# EAGLE design Ayrduino_v6_mint (EAGLE 6.4)
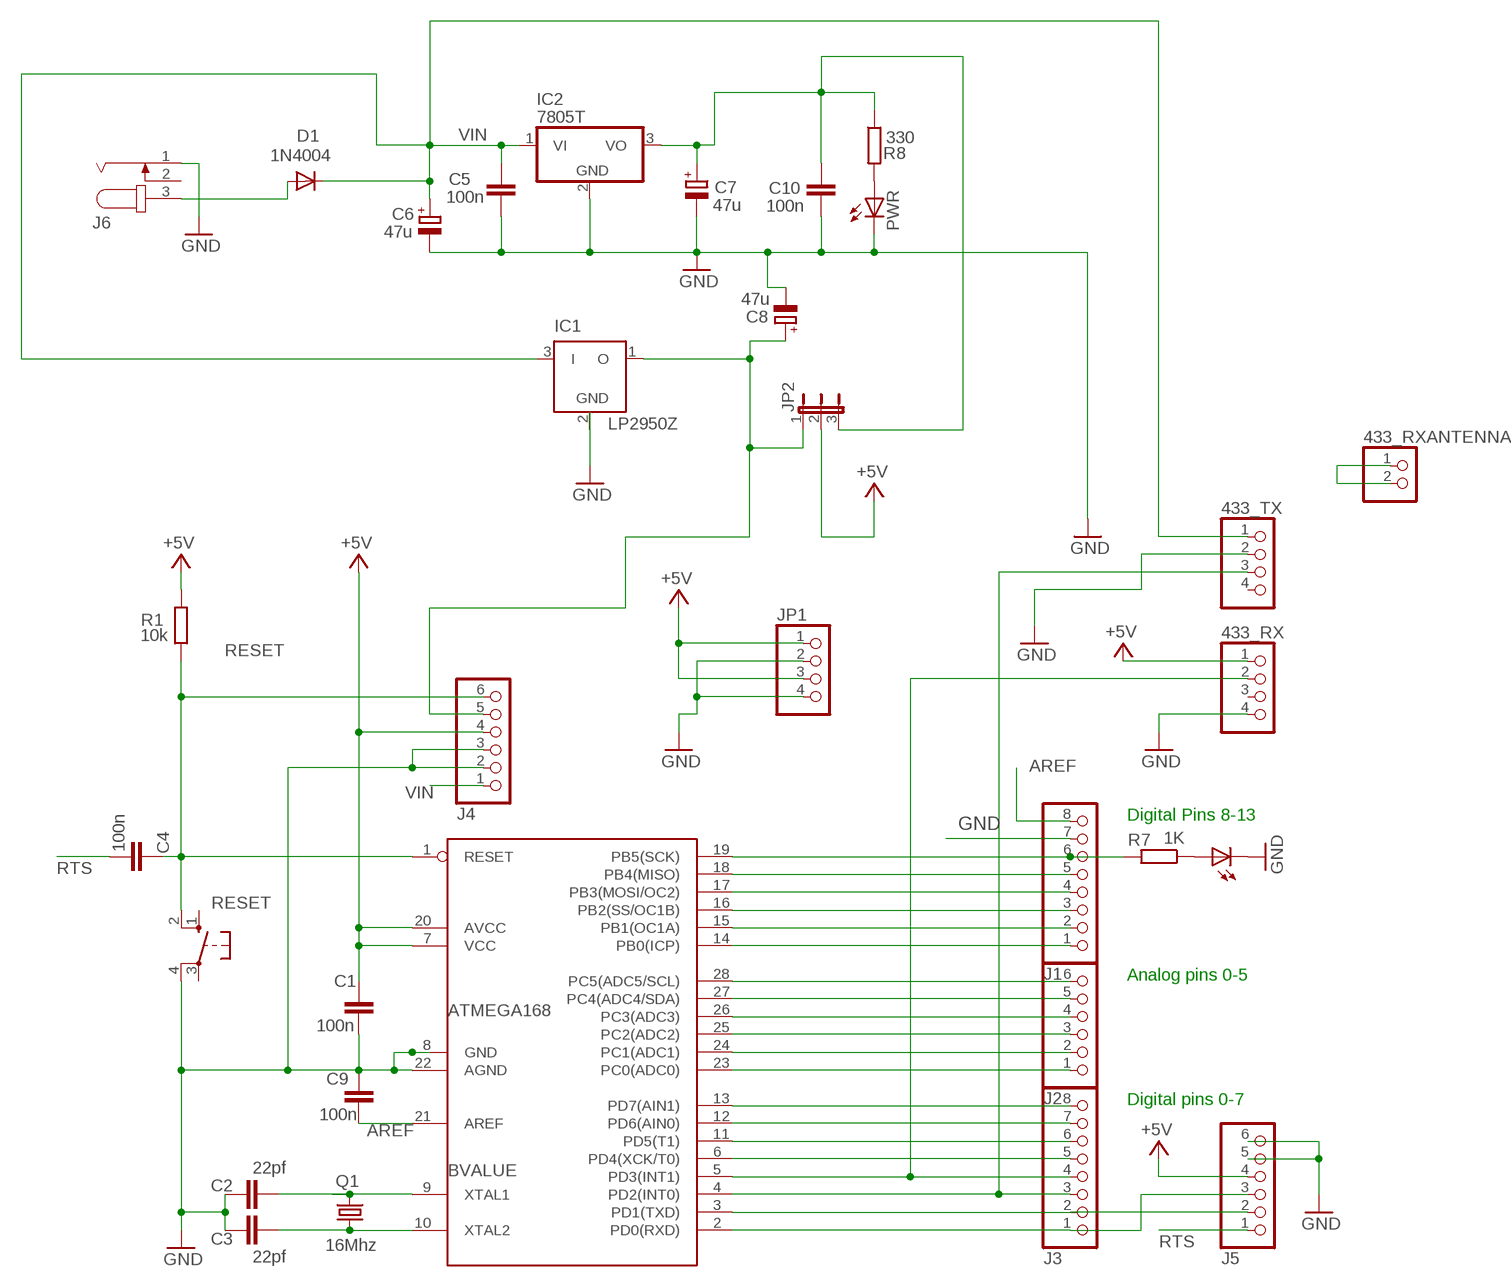
[diagram p0: schematic, sheet 1]

## Parts
433_RX  PINHD-1X4  [1X04]
433_RXANTENNA  PINHD-1X2  [1X02]
433_TX  PINHD-1X4  [1X04]
BVALUE  ATMEGA168  MEGA8-P  [DIL28-3]
C1  100n  C-EU050-024X044  [C050-024X044]
C2  22pf  C-EU025-024X044  [C025-024X044]
C3  22pf  C-EU025-024X044  [C025-024X044]
C4  100n  C-EU050-024X044  [C050-024X044]
C5  100n  C-EU050-024X044  [C050-024X044]
C6  47u  CPOL-EUE3.5-8  [E3,5-8]
C7  47u  CPOL-EUE3.5-8  [E3,5-8]
C8  47u  CPOL-EUE3.5-8  [E3,5-8]
C9  100n  C-EU050-024X044  [C050-024X044]
C10  100n  C-EU050-024X044  [C050-024X044]
D1  1N4004  DIODEPTH  [DIODE-0.4]
IC1  LP2950Z  [TO92]
IC2  7805T  [TO220H]
J1  PINHD-1X8  [1X08]
J2  PINHD-1X6  [1X06]
J3  PINHD-1X8  [1X08]
J4  PINHD-1X6  [1X06]
J5  PINHD-1X6  [1X06]
J6  JACK-PLUG0  [SPC4077]
JP1  PINHD-1X4  [1X04]
JP2  JP2E  [JP2]
P13  LED3MM  [LED3MM]
PWR  LED3MM  [LED3MM]
Q1  16Mhz  CRYSTALHC49U-V  [HC49U-V]
R1  10k  R-EU_0204/7  [0204/7]
R7  1K  R-EU_0204/7  [0204/7]
R8  330  R-EU_0204/7  [0204/7]
RESET  10-XX  [B3F-10XX]

## Nets
+5V [power]: 433_RX.1 BVALUE.7(VCC) BVALUE.20(AVCC) C1.1 J4.4 J5.4 JP1.1 JP1.3 JP2.2 R1.2
AREF: BVALUE.21(AREF) C9.1 J1.8
GND [power]: 433_RX.4 433_TX.2 BVALUE.8(GND) BVALUE.22(AGND) C1.2 C2.1 C3.1 C5.1 C6.- C7.- C8.- C9.2 C10.1 IC2.2(GND) J1.7 J4.2 J4.3 J5.5 J5.6 J6.1 JP1.2 JP1.4 P13.K(C) PWR.K(C) RESET.4(P1)
N$1: BVALUE.2(PD0(RXD)) J3.1 J5.3
N$2: BVALUE.15(PB1(OC1A)) J1.2
N$3: PWR.A R8.2
N$5: D1.A J6.3
N$6: BVALUE.9(XTAL1) C2.2 Q1.2
N$9: C8.+ IC1.1(O) J4.5 JP2.1
N$10: 433_TX.3 BVALUE.4(PD2(INT0)) J3.3
N$11: 433_RX.2 BVALUE.5(PD3(INT1)) J3.4
N$12: BVALUE.6(PD4(XCK/T0)) J3.5
N$13: BVALUE.11(PD5(T1)) J3.6
N$14: BVALUE.12(PD6(AIN0)) J3.7
N$15: BVALUE.13(PD7(AIN1)) J3.8
N$16: BVALUE.23(PC0(ADC0)) J2.1
N$17: BVALUE.24(PC1(ADC1)) J2.2
N$18: BVALUE.25(PC2(ADC2)) J2.3
N$19: BVALUE.26(PC3(ADC3)) J2.4
N$20: BVALUE.27(PC4(ADC4/SDA)) J2.5
N$21: BVALUE.28(PC5(ADC5/SCL)) J2.6
N$22: BVALUE.3(PD1(TXD)) J3.2 J5.2
N$23: BVALUE.16(PB2(SS/OC1B)) J1.3
N$24: 433_RXANTENNA.1 433_RXANTENNA.2
N$25 [power]: C7.+ C10.2 IC2.3(VO) JP2.3 R8.1
N$26: BVALUE.18(PB4(MISO)) J1.5
N$28: BVALUE.14(PB0(ICP)) J1.1
N$31: BVALUE.10(XTAL2) C3.2 Q1.1
N$32: P13.A R7.1
N$43: BVALUE.17(PB3(MOSI/OC2)) J1.4
RESET: BVALUE.1(RESET) C4.1 J4.6 R1.1 RESET.2(S1)
RTS: C4.2 J5.1
SCK: BVALUE.19(PB5(SCK)) J1.6 R7.2
VIN [power]: 433_TX.1 C5.2 C6.+ D1.C IC1.3(I) IC2.1(VI) J4.1
Unconnected: 433_RX.3 433_TX.4 J6.2 RESET.1(S) RESET.3(P)

## Notes on the sheet
- Digital Pins 8-13
- Analog pins 0-5
- Digital pins 0-7

## Power pins joined to a net without a drawn wire
GND: IC1.2(GND)

## Library data of the parts
433_RX 433_TX JP1 = pinhead:PINHD-1X4: PIN HEADER
433_RXANTENNA = pinhead:PINHD-1X2: PIN HEADER
BVALUE = my-library:MEGA8-P: MICROCONTROLLER 8 Kbytes FLASH 1 kbytes SRAM 512 bytes EEPROM USART 4-channel 10 bit ADC 2-channel 8 bit ADC Source: avr.lbr
C1-C5 C9 C10 = rcl:C-EU: CAPACITOR, European symbol
C6-C8 = rcl:CPOL-EU: POLARIZED CAPACITOR, European symbol
D1 = SparkFunEagle-6-6-07:DIODE: Diode These are standard reverse protection diodes and small signal diodes. SMA package can handle up to about 1A. SOD-323 can handle about 200mA. What the SOD-323 package when ordering, there are some mfgs out there that are 5-pin packages.
IC1 = linear:LP2950: 100 mA, Low Power Low Dropout Voltage Regulator Source: http://www.onsemi.com/pub/Collateral/LP2950-D.PDF
IC2 = linear:78*: Positive VOLTAGE REGULATOR Source: http://cache.national.com/ds/LM/LM78L05.pdf http://www.fairchildsemi.com/ds/LM/LM7805.pdf
J1 J3 = pinhead:PINHD-1X8: PIN HEADER
J2 J4 J5 = pinhead:PINHD-1X6: PIN HEADER
J6 = con-jack:JACK-PLUG: DC POWER JACK Power Jack, DC, Right Angle, Through Hole, Rated 5A at 16VDC, PC Terminals Distributor: Farnell (www.Farnell.de) Drawing: 84N1161.pdf / 84N1162.pdf Manufacturer: SPC Technology (www.spctechnology.com) Type: SPC4077 / SPC 4078; OC_FARNELL: unknown; OC_NEWARK: unknown
JP2 = jumper:JP2E: JUMPER
P13 PWR = led:LED: LED OSRAM: - CHIPLED LG R971, LG N971, LY N971, LG Q971, LY Q971, LO R971, LY R971 LH N974, LH R974 LS Q976, LO Q976, LY Q976 LO Q996 - Hyper CHIPLED LW Q18S LB Q993, LB Q99A, LB R99A - SideLED LS A670, LO A670, LY A670, LG A670, LP A670 LB A673, LV A673, LT A673, LW A673 LH A674 LY A675 LS A676, LA A676, LO A676, LY A676, LW A676 LS A679, LY A679, LG A679 - Hyper Micro SIDELED® LS Y876, LA Y876, LO Y876, LY Y876 LT Y87S - SmartLED LW L88C, LW L88S LB L89C, LB L89S, LG L890 LS L89K, LO L89K, LY L89K LS L896, LA L896, LO L896, LY L896 - TOPLED LS T670, LO T670, LY T670, LG T670, LP T670 LSG T670, LSP T670, LSY T670, LOP T670, LYG T670 LG T671, LOG T671, LSG T671 LB T673, LV T673, LT T673, LW T673 LH T674 LS T676, LA T676, LO T676, LY T676, LB T676, LH T676, LSB T676, LW T676 LB T67C, LV T67C, LT T67C, LS T67K, LO T67K, LY T67K, LW E67C LS E67B, LA E67B, LO E67B, LY E67B, LB E67C, LV E67C, LT E67C LW T67C LS T679, LY T679, LG T679 LS T770, LO T770, LY T770, LG T770, LP T770 LB T773, LV T773, LT T773, LW T773 LH T774 LS E675, LA E675, LY E675, LS T675 LS T776, LA T776, LO T776, LY T776, LB T776 LHGB T686 LT T68C, LB T68C - Hyper Mini TOPLED® LB M676 - Mini TOPLED Santana® LG M470 LS M47K, LO M47K, LY M47K Source: http://www.osram.convergy.de/
Q1 = crystal:CRYSTAL: CRYSTAL
R1 R7 R8 = rcl:R-EU_: RESISTOR, European symbol
RESET = switch-omron:10-XX: OMRON SWITCH

## Net classes
0 default: width 0.203 mm, clearance 0.203 mm
1 power: width 0.6 mm, clearance 0.305 mm
2 finepitch: width 0.203 mm, clearance 0.203 mm

## Board
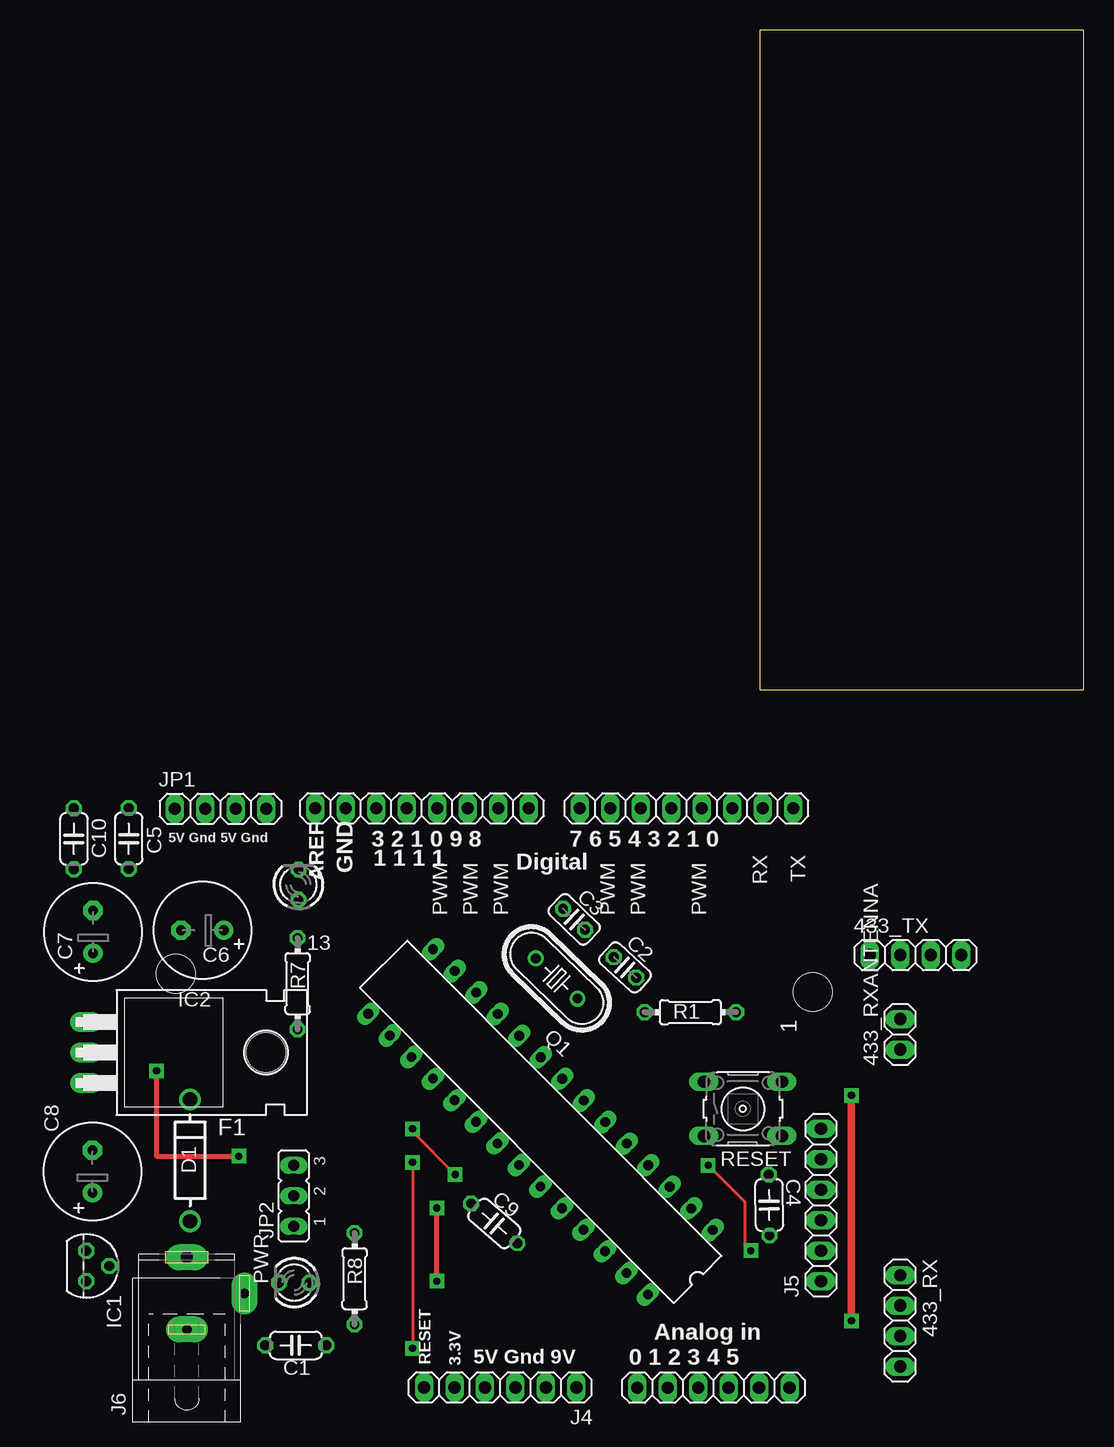
[diagram p1: board, top side]
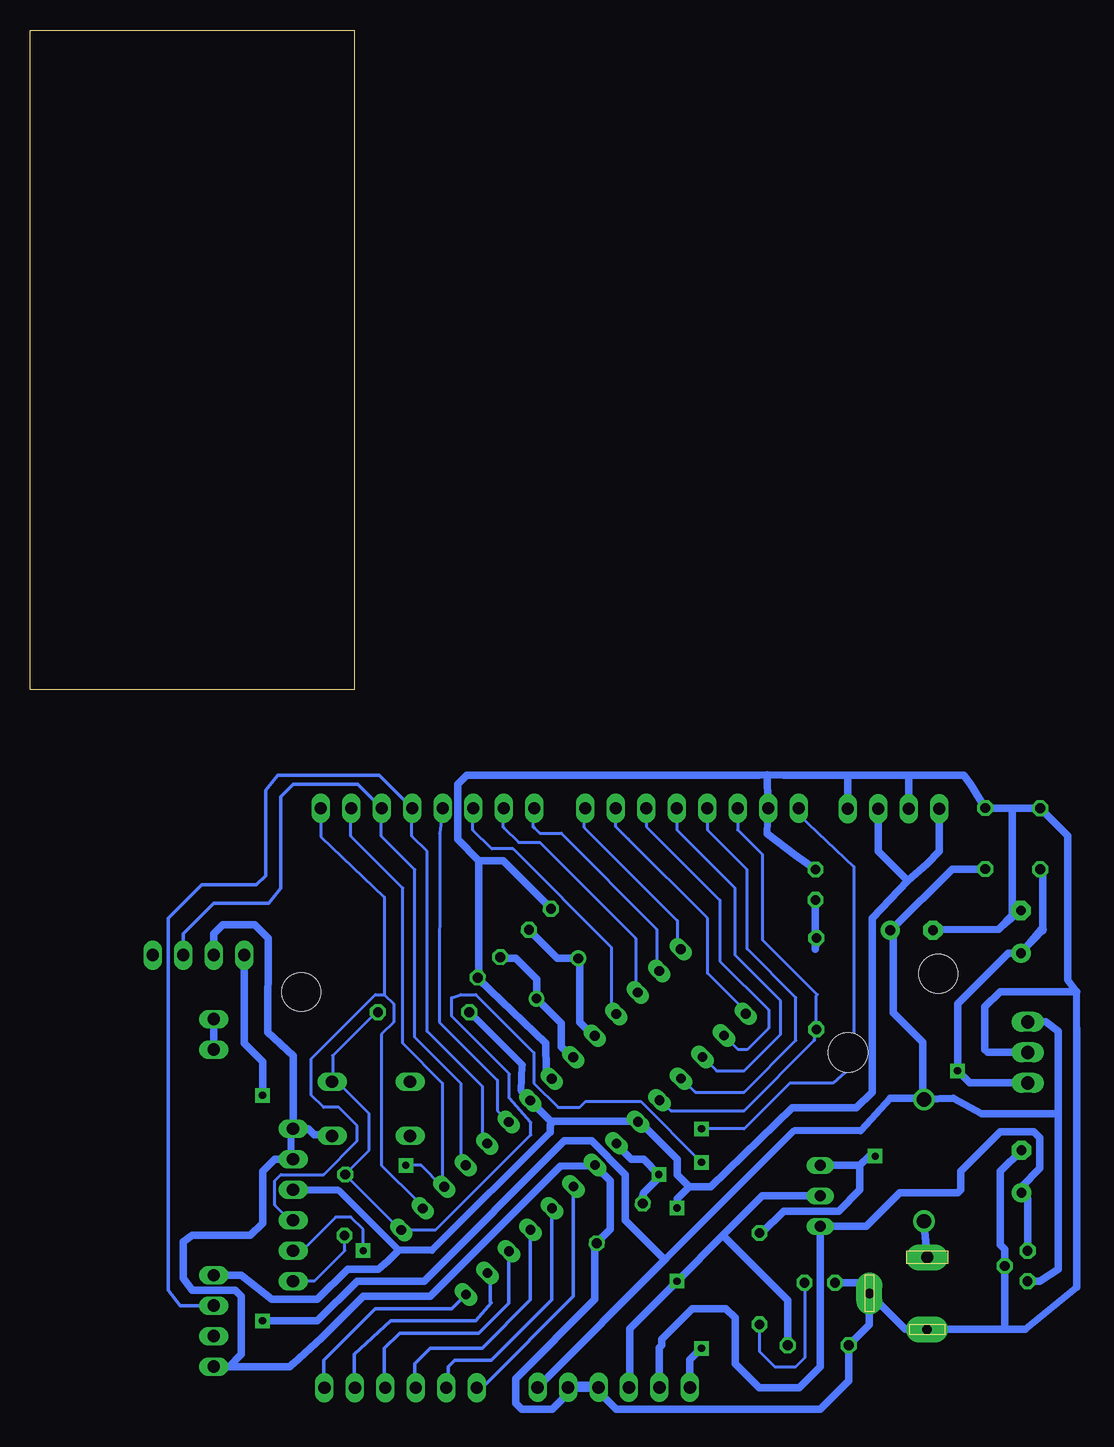
[diagram p2: board, bottom side, seen from below]

Size 27 x 54.99 mm. Coordinates in mm from the lower left corner, seen from the top.
Copper layers (1*16): Top 0.035mm / dielectric 1.5mm / Bottom 0.035mm
Design rules "default": minimum track width 10mil, minimum drill 0.6mm, track to track 8mil, track to pad 8mil, pad to pad 8mil, via to via 12mil, smd to smd 8mil, copper to edge 10mil, drill to drill 15mil, minimum pad ring 10mil, minimum via ring 12mil, stop-mask expansion 4mil, vias tented up to drill 0mil, thermal gap 10mil
Holes 3.2 mm at -48.69,-23.66 4.4,-25.18
tRestrict: area -47.5,-11.8 to -43.8,-8; area 3.2,-27.1 to 7,-23.3; area 3.2,-55 to 7,-51.2; 10 lines
bRestrict: area -47.5,-11.8 to -43.8,-8; area 3.2,-27.1 to 7,-23.3; area 3.2,-55 to 7,-51.2; 8 lines

### Footprints (pad centres in the part's own frame; a part is rotated, then mirrored left to right if it is on the bottom)
1X04 = drill 1.016 long: 1 -3.81,0; 2 -1.27,0; 3 1.27,0; 4 3.81,0
1X02 = drill 1.016 long: 1 -1.27,0; 2 1.27,0
DIL28-3 = drill 0.813 long: 1 -16.51,-3.81; 2 -13.97,-3.81; 3 -11.43,-3.81; 4 -8.89,-3.81; 5 -6.35,-3.81; 6 -3.81,-3.81; 7 -1.27,-3.81; 8 1.27,-3.81; 9 3.81,-3.81; 10 6.35,-3.81; 11 8.89,-3.81; 12 11.43,-3.81; 13 13.97,-3.81; 14 16.51,-3.81; 15 16.51,3.81; 16 13.97,3.81; 17 11.43,3.81; 18 8.89,3.81; 19 6.35,3.81; 20 3.81,3.81; 21 1.27,3.81; 22 -1.27,3.81; 23 -3.81,3.81; 24 -6.35,3.81; 25 -8.89,3.81; 26 -11.43,3.81; 27 -13.97,3.81; 28 -16.51,3.81
C050-024X044 = drill 0.813 octagon: 1 -2.54,0; 2 2.54,0
C025-024X044 = drill 0.813 octagon: 1 -1.27,0; 2 1.27,0
E3,5-8 = drill 0.813 pad 1.6: + -1.778,0 | drill 0.813 pad 1.6 octagon: - 1.778,0
DIODE-0.4 = drill 1.2: A 0,0; C 10.16,0
TO92 = drill 0.813 octagon: 1 -1.27,0; 2 0,1.905; 3 1.27,0
TO220H = drill 1.118 long: 1 -2.54,-10.16; 2 0,-10.16; 3 2.54,-10.16 | hole 3.302: 0,4.826
1X08 = drill 1.016 long: 1 -8.89,0; 2 -6.35,0; 3 -3.81,0; 4 -1.27,0; 5 1.27,0; 6 3.81,0; 7 6.35,0; 8 8.89,0
1X06 = drill 1.016 long: 1 -6.35,0; 2 -3.81,0; 3 -1.27,0; 4 1.27,0; 5 3.81,0; 6 6.35,0
SPC4077 = drill 0.8 pad 2.184 long: 1 -3,0; 2 0,-4.8 | drill 1 pad 2.184 long: 3 3,0
JP2 = drill 0.914 long: 1 -2.54,0; 2 0,0; 3 2.54,0
LED3MM = drill 0.813 octagon: A -1.27,0; K 1.27,0
HC49U-V = drill 0.813: 1 -2.413,0; 2 2.413,0
0204/7 = drill 0.813 octagon: 1 -3.81,0; 2 3.81,0
B3F-10XX = drill 1.016 long: 1 -3.251,2.261; 2 3.251,2.261; 3 -3.251,-2.261; 4 3.251,-2.261

### Placement (x,y rotation side)
433_RX  11.68,-52.58 270 top  (outside the outline)
433_RXANTENNA  11.68,-28.7 90 top  (outside the outline)
433_TX  12.95,-22.1 0 top  (outside the outline)
BVALUE  -18.28,-36 134.9 top  (outside the outline)
C1  -38.68,-54.62 180 top  (outside the outline)
C2  -11.25,-23.13 137.6 top  (outside the outline)
C3  -15.49,-19.12 316.2 top  (outside the outline)
C4  0.76,-42.93 270.7 top  (outside the outline)
C5  -52.6,-12.39 270 top  (outside the outline)
C6  -46.47,-20.03 180 top  (outside the outline)
C7  -55.58,-20.16 90 top  (outside the outline)
C8  -55.63,-40.13 90 top  (outside the outline)
C9  -22.15,-44.46 319.2 top  (outside the outline)
C10  -57.18,-12.41 270 top  (outside the outline)
D1  -47.49,-44.28 90 top  (outside the outline)
IC1  -56.13,-48.01 270 top  (outside the outline)
IC2  -45.99,-30.21 270 top  (outside the outline)
J1  -28.17,-9.87 180 top  (outside the outline)
J2  -3.89,-58.15 0 top  (outside the outline)
J3  -6.12,-9.87 180 top  (outside the outline)
J4  -21.65,-58.13 180 top  (outside the outline)
J5  5.08,-42.93 90 top  (outside the outline)
J6  -47.75,-50.29 90 top  (outside the outline)
JP1  -44.96,-9.91 0 top  (outside the outline)
JP2  -38.86,-42.16 90 top  (outside the outline)
P13  -38.46,-16.23 90 top  (outside the outline)
PWR  -38.81,-49.41 180 top  (outside the outline)
Q1  -16.94,-24.05 316 top  (outside the outline)
R1  -5.8,-26.86 180 top  (outside the outline)
R7  -38.53,-24.48 270 top  (outside the outline)
R8  -33.79,-49.07 270 top  (outside the outline)
RESET  -1.42,-34.91 0 top  (outside the outline)

### Tracks (layer width: path | path; a pad name or v marks a point on that pad's centre or on a via)
+5V  (via drill 0.6)
  Top 0.406: v-26.92,-49.28 v-26.92,-43.18
  Bottom 0.6: -14.71,-34.46 BVALUE.7 -13.95,-33.45 -14.03,-31.24 -9.71,-26.96 R1.2 | -16.34,-36.85 -6.49,-46.71 -3.71,-46.71 1.29,-41.71 5.04,-41.71 J5.4 | -22.96,-57.96 J4.4
  Bottom 0.61: -14.71,-34.46 -14.9,-34.46 -16.51,-36.07 | -16.51,-36.07 -16.62,-35.96 -23.63,-35.96 BVALUE.20 -23.44,-35.99 -23.37,-36.07 -23.88,-36.07 -26.92,-39.12 -26.92,-40.39 -27.94,-41.4 | -27.94,-41.4 -29.72,-41.4 -36.53,-34.84 -41.87,-34.84 -43.18,-33.53 -43.18,-19.05 -46.16,-15.91 | -46.16,-15.91 -47.75,-14.48 -48.77,-13.46 JP1.1 | JP1.3 -43.69,-13.44 -46.16,-15.91 | -16.34,-36.85 -16.34,-36.24 -16.51,-36.07 | -3.71,-46.71 -2.79,-47.62 -2.03,-48.26 0.51,-48.26 3.05,-50.8 6.86,-50.8 9.4,-48.77 433_RX.1 | -22.96,-57.96 -22.96,-53.24 v-26.92,-49.28 -30.73,-45.47 | -30.73,-45.47 -34.04,-42.16 JP2.2 | C1.1 -36.14,-50.87 -30.73,-45.47 | v-26.92,-43.18 -26.92,-42.42 -27.94,-41.4
AREF  (via drill 0.6)
  Top 0.254: v-28.96,-36.58 -28.96,-36.83 v-25.4,-40.39
  Bottom 0.254: J1.8 -37.06,-10.39 -41.66,-14.73 -41.66,-31.24 -39.88,-32.77 -36.32,-32.77 -32.51,-36.58 v-28.96,-36.58
  Bottom 0.61: BVALUE.21 -21.88,-37.88 -23.11,-39.12 -24.13,-39.12 v-25.4,-40.39 -25.4,-40.64 -24.13,-41.91 -23.88,-42.74 C9.1
GND
  Bottom 0.6: -34.46,-11.99 J1.7 -34.46,-9.71 | 5.29,-36.71 J5.6 5.29,-36.71 | 5.29,-36.71 5.29,-38.96 J5.5 | -17.27,-39.71 -19.96,-39.71 BVALUE.22 | C7.- -53.71,-19.96 -48.46,-19.96 C6.- | J4.3 -20.21,-58.21 -17.96,-58.21 J4.2 -18.21,-57.96 | -60.22,-28.21 -60.22,-25.15 -59.46,-24.16 | C9.2 -19.96,-46.46 -20.07,-46.46 | 1.79,-37.08 1.79,-36.96 RESET.4 | C2.1 -10.21,-23.96 -10.41,-23.96
  Bottom 0.61: -19.96,-39.71 -20.15,-39.71 -21.34,-40.89 -21.34,-44.96 -20.07,-46.23 | -19.96,-46.12 -20.07,-46.23 | -20.07,-46.23 -20.07,-46.46 -20.07,-50.8 -13.46,-57.4 -13.46,-59.44 -13.97,-59.94 -16.51,-59.94 -18.29,-58.17 -20.07,-58.17 -20.32,-58.42 | -34.46,-9.71 -34.46,-9.48 -34.43,-7.07 | -34.43,-7.07 -35.81,-7.11 -41.15,-7.11 | -41.15,-7.11 -46.23,-7.11 | -46.23,-7.11 -50.8,-7.11 -51.37,-7.82 C5.1 -52.63,-9.87 -54.86,-9.87 | BVALUE.8 -16.48,-32.23 -16,-31.75 -15.97,-29.44 -10.41,-24.13 -10.41,-23.96 -10.41,-14.22 | -10.41,-14.22 -8.64,-12.45 -8.64,-7.87 -9.4,-7.11 -33.72,-7.11 -34.43,-7.07 | C3.1 -16.41,-18.19 -12.45,-14.22 -10.41,-14.22 | J4.2 -20.28,-58.13 | -20.28,-58.13 -20.32,-58.42 | -20.32,-58.42 -21.84,-59.94 -38.86,-59.94 -41.22,-57.59 C1.2 -42.93,-52.91 -42.93,-50.29 | -18.21,-57.96 -20.36,-57.96 -20.28,-58.13 | 1.78,-37.08 1.79,-37.08 3.3,-37.08 3.81,-36.58 J5.6 5.08,-30.48 7.18,-28.52 7.13,-20.71 8.27,-19.56 10.92,-19.56 11.68,-20.32 433_TX.2 | -59.46,-24.16 -59.46,-12.15 C10.1 -54.86,-9.87 | JP1.2 -46.23,-7.11 | JP1.4 -41.15,-7.11 | -17.27,-39.71 -17.19,-39.71 -6.35,-50.55 -0.76,-50.55 2.69,-53.97 5.08,-56.15 5.1,-56.15 5.33,-56.39 433_RX.4 10.41,-56.39 9.4,-55.37 9.4,-50.55 9.91,-50.04 13.46,-50.04 14.22,-49.02 14.22,-45.97 13.46,-45.47 8.64,-45.47 7.62,-44.45 7.62,-40.13 6.6,-39.12 J5.5 5.84,-39.12 | -42.93,-50.29 -45.93,-53.29 J6.1 -54.1,-53.29 | -60.22,-28.21 -60.22,-49.76 -55.93,-53.29 -54.1,-53.29 | -34.46,-11.99 -36.74,-13.76 P13.K | -53.71,-19.96 -53.71,-19.95 -54.86,-18.8 -54.86,-9.87 | C8.- -53.85,-40.13 -53.85,-46.23 -54.23,-46.61 IC1.2 -54.23,-53.17 -54.1,-53.29
  Bottom 0.61: IC2.2 -52.82,-30.22 -52.58,-29.97 -52.58,-26.42 -53.85,-25.15 -60.22,-25.15 | PWR.K -42.04,-49.41 -42.93,-50.29
N$1
  Bottom 0.254: J3.1 2.77,-12.22 -2.54,-17.27 -2.54,-25.4 | -2.54,-25.4 -3.3,-26.16 -3.3,-27.69 -2.29,-28.7 -2.29,-39.62 -5.33,-42.67 -5.08,-42.57 BVALUE.2 | J5.3 5.33,-44.2 6.6,-42.93 6.6,-40.89 6.1,-40.39 2.54,-40.39 -0.25,-37.59 -0.25,-36.32 1.27,-34.8 2.54,-34.8 3.56,-33.78 3.56,-30.73 -1.78,-25.4 -2.54,-25.4
N$2
  Bottom 0.254: BVALUE.15 -32.64,-26.79 -29.46,-23.62 -29.46,-19.04 -22.86,-12.45 -21.82,-11.41 J1.2
N$3
  Bottom 0.254: R8.2 -33.78,-55.12 -35.05,-56.39 -36.83,-56.39 -37.59,-55.63 -37.59,-49.46 PWR.A
N$5
  Bottom 0.61: J6.3 -47.49,-44.24 D1.A
N$6
  Bottom 0.61: BVALUE.9 -18.17,-30.61 -17.27,-29.72 -17.27,-27.79 Q1.2 -15.21,-24.1 -13.46,-22.35 -12.26,-22.35 C2.2
N$8  (via drill 0.6)
  other vias: -50.29,-31.75
N$9
  Bottom 0.61: J4.5 -25.46,-54.81 -25.65,-54.61 -25.65,-54.1 -28.19,-51.56 -30.99,-51.56 -31.75,-52.32 -31.75,-56.13 -33.78,-58.17 -37.08,-58.17 -38.86,-56.39 JP2.1 -42.67,-44.7 -45.47,-41.91 -50.29,-41.91 -50.55,-41.66 -50.55,-40.13 -53.85,-36.83 -56.64,-36.83 -57.15,-37.34 -57.15,-39.88 -55.63,-41.4 C8.+ -56.13,-42.42 IC1.1
N$10
  Bottom 0.254: J3.3 -2.29,-10.1 -2.29,-12.19 -5.08,-14.99 -5.08,-28.96 -8.89,-32.77 -8.89,-39.12 -9.4,-39.62 -9.46,-39.71 BVALUE.4
  Bottom 0.305: J3.3 -0.32,-7.87 5.08,-7.87 6.1,-8.89 6.1,-16.51 7.11,-17.78 11.68,-17.78 14.22,-20.32 433_TX.3
N$11
  Bottom 0.254: J3.4 -4.83,-10.6 -4.83,-12.19 -6.1,-13.46 -6.1,-28.45 -10.67,-33.02 -10.67,-37.34 -11,-37.67 | -11,-37.67 -11.18,-37.85 | BVALUE.5 -10.96,-37.71 -11,-37.67
  Bottom 0.305: J3.4 -2.1,-7.11 6.35,-7.11 7.37,-8.38 7.37,-15.49 8.13,-16.26 12.7,-16.26 15.49,-19.05 15.49,-50.04 14.48,-51.31 433_RX.2
N$12
  Bottom 0.254: -12.7,-36.01 BVALUE.6 -12.71,-35.96 -12.78,-35.89 | J3.5 -7.14,-11.96 -7.11,-27.69 -11.94,-32.51 -11.94,-35.05 -12.78,-35.89 | -12.78,-35.89 -12.95,-36.07
N$13
  Bottom 0.254: BVALUE.11 -21.46,-26.7 -21.46,-21.45 -13.26,-13.26 -11.48,-13.26 -9.91,-11.68 J3.6
N$14
  Bottom 0.254: BVALUE.12 -23.46,-25.21 -23.46,-20.71 -15.75,-12.95 -15.49,-12.7 -13.72,-12.7 -12.5,-11.48 -12.46,-11.48 J3.7
N$15
  Bottom 0.254: BVALUE.13 -25.21,-23.21 -25.21,-19.96 -17.27,-11.94 -15.49,-11.94 -15.04,-11.48 -14.96,-11.48 J3.8
N$16
  Bottom 0.305: J2.1 -10.4,-58.15 -10.92,-57.91 -18.29,-50.55 BVALUE.23
N$17
  Bottom 0.254: -8.13,-57.66 -7.97,-57.63 | -7.97,-57.63 -7.7,-57.58 | -7.97,-57.63 -7.96,-57.71 J2.2
  Bottom 0.305: BVALUE.24 -16.5,-50.81 -11.43,-55.88 -8.38,-55.88 -7.87,-56.39 -7.87,-57.98 J2.2
N$18
  Bottom 0.305: BVALUE.25 -14.71,-50.83 -10.67,-54.86 -6.35,-54.86 -5.08,-56.13 -5.08,-58.08 J2.3
N$19
  Bottom 0.305: BVALUE.26 -12.91,-51.09 -10.41,-53.59 -3.81,-53.59 -2.54,-54.86 -2.54,-58.08 J2.4
N$20
  Bottom 0.305: J2.5 0,-58.08 0,-55.37 -3.05,-52.58 -10.16,-52.58 -11.43,-51.05 -11.37,-51 -11.37,-49.08 -11.43,-49.02 -11.43,-48.9 BVALUE.27
N$21
  Bottom 0.305: BVALUE.28 -9.3,-50.39 -8.13,-51.56 -1.78,-51.56 2.54,-55.88 2.54,-58.08 J2.6
N$22  (via drill 0.6)
  Top 0.254: v-4.32,-39.62 -1.27,-42.67 -1.27,-46.23 v-0.76,-46.74
  Bottom 0.254: J3.2 0.25,-9.84 0.25,-12.19 -4.06,-16.51 -4.06,-29.46 -7.37,-32.77 -7.37,-41.26 BVALUE.3 -7.37,-41.41 -5.59,-39.62 v-4.32,-39.62 | v-0.76,-46.74 -0.76,-44.96 0.25,-43.94 1.52,-43.94 4.32,-46.74 J5.2
N$23
  Bottom 0.254: J1.3 -24.36,-11.41 -30.48,-17.53 -30.48,-22.61 -34.54,-26.67 -34.54,-28.19 -32.77,-29.97 -32.02,-29.97 BVALUE.16
N$24
  Bottom 0.61: 433_RXANTENNA.2 433_RXANTENNA.1
N$25  (via drill 0.6)
  Top 0.406: v-50.29,-31.75 -50.29,-38.86 v-43.43,-38.86
  Bottom 0.6: -57.46,-19.96 C7.+ -57.21,-19.96 -57.4,-19.96
  Bottom 0.61: -57.4,-20.07 -57.4,-19.96 -57.4,-15.18 C10.2 | IC2.3 -51.3,-32.76 v-50.29,-31.75 -50.29,-26.16 -54.51,-21.94 C7.+ | v-43.43,-38.86 -42.93,-38.86 -42.16,-39.62 | JP2.3 -42.16,-39.62 | R8.1 -33.99,-45.26 -35.81,-43.43 -40.39,-43.43 -42.16,-41.66 -42.16,-39.62
N$26
  Bottom 0.254: BVALUE.18 -27.31,-32.39 -28.45,-33.53 -32.51,-33.53 -36.83,-29.21 -36.83,-25.65 -32.77,-21.59 -32.77,-14.99 -29.46,-11.68 -29.46,-9.89 J1.5
N$27  (via drill 0.6)
  other vias: -43.43,-38.86
N$28
  Bottom 0.254: BVALUE.14 -26.96,-21.2 -26.96,-19.23 -19.21,-11.48 J1.1
N$29  (via drill 0.6)
  other vias: -26.92,-43.18
N$31
  Bottom 0.61: BVALUE.10 -19.92,-28.82 -18.8,-27.69 -18.8,-22.49 Q1.1 -16.95,-22.37 C3.2
N$32
  Bottom 0.61: P13.A -38.46,-21.61 R7.1
N$43
  Bottom 0.254: BVALUE.17 -29.07,-30.6 -30.23,-31.75 -32.51,-31.75 -35.56,-28.7 -35.56,-25.91 -31.75,-22.1 -31.75,-16.51 -26.92,-11.68 -26.92,-9.89 J1.4
RESET  (via drill 0.6)
  Top 0.254: v-28.96,-39.37 v-28.96,-54.86
  Bottom 0.254: R1.1 -1.84,-26.86 1.78,-30.48 1.78,-32.6 RESET.2 1.38,-32.65 -1.27,-35.31 -1.27,-38.35 0.76,-40.39 0.74,-40.41 | 0.74,-40.41 -3.86,-45.01 BVALUE.1 -6.81,-45.01 -14.73,-37.08 -14.73,-36.07 -12.95,-34.04 -12.95,-32 -8.13,-27.18 -8.13,-25.65 -8.89,-25.4 -10.16,-25.4 -14.99,-30.23 -14.99,-32.77 -17.02,-34.8 -18.8,-34.8 -19.3,-34.29 -23.88,-34.29 v-28.96,-39.37 | C4.1 0.79,-40.46 0.74,-40.41
  Bottom 0.61: J4.6 -28,-55.82 v-28.96,-54.86
RTS
  Bottom 0.254: J5.1 3.3,-49.28 0.76,-46.74 0.76,-45.5 C4.2
SCK
  Bottom 0.254: J1.6 -31.98,-11.66 -34.04,-13.72 -34.04,-20.83 -38.61,-25.4 -38.53,-25.47 R7.2 -38.61,-28.36 -38.35,-29.21 -32.51,-35.05 -26.42,-35.05 -25.56,-34.19 BVALUE.19
VIN  (via drill 0.6)
  Top 0.61: v7.62,-52.58 v7.62,-33.78
  Bottom 0.6: -44.7,-34.04 -42.22,-36.75 -36.66,-36.75 -15.46,-57.96 J4.1 | -44.46,-19.96 C6.+ | -44.71,-20.21 C6.+ | -44.76,-20.01 -44.71,-19.96 C6.+
  Bottom 0.61: -15.46,-57.96 -15.46,-57.95 -25.91,-47.5 -22.61,-44.2 -22.61,-40.39 -19.81,-37.59 -17.53,-37.59 -5.84,-49.28 -0.25,-49.28 3.05,-52.58 v7.62,-52.58 | v7.62,-33.78 7.62,-30.99 9.14,-29.46 433_TX.1 | -44.7,-20.07 -44.76,-20.01 -49.84,-14.93 C5.2 | -44.7,-34.04 -47.41,-34.04 | -47.41,-34.04 D1.C -49.95,-34.04 -52.32,-35.31 -58.67,-35.31 | IC1.3 -57.15,-49.28 -58.67,-48.26 -58.67,-35.31 | -47.41,-34.04 -47.41,-29.37 -44.96,-26.92 -44.96,-20.3 C6.+ | IC2.1 -57.65,-27.68 -58.67,-28.45 -58.67,-35.31

### Text on the board
tPlace: RESET | 3.3V
tNames: 5V Gnd 5V Gnd | 3 2 1 0 9 8 | 7 6 5 4 3 2 1 0 | RX | TX | 1 1 1 1 | Digital | AREF | GND | PWM | PWM | PWM | PWM | PWM | PWM | 13 | 1 | F1 | Analog in | 5V Gnd 9V | 0 1 2 3 4 5
Edit History: 20070917 WestfW: Move (CC) symbol, use silk_gen to get 5mil widths | 20070917 WestfW: Manual route some, autoroute rest. Fiddle. | 20070917 WestfW: Now V1.16. Change components to TH. | 20070911 WestfW: Now V1.15. Move tracks slightly for shielding | 20070900 Daniel: Schematic and initial placement
_tsilk: C12 | C8 | 3 2 1 0 9 8 | 7 6 5 4 3 2 1 0 | RX | TX | 1 1 1 1 | Digital | X2 | AREF | GND | R7 | PWM | PWM | PWM | PWM | PWM | PWM | PWR | IC1 | 13 | Freeduino | FT232RL | c | c | R10 | V1.16 | TX | R8 | RX | 16Mhz | 1 | R1 | R9 | C3 | C10 | R12 | ]USB | R11 | ]EXT | F1 | Q1 | C2 | ICSP | RESET | 1 | CRS | M. Banzi | D. Cuartielles | D. Mellis | N. Zambetti | C5 | C4 | ATMEGA168 | IC2 | D1 | C1 | 47u | C7 | 47u | C6 | C9 | Analog in | 5V Gnd 9V | RESET | 3.3V | 0 1 2 3 4 5 | 9V in